# Altium schematic sheet 1.MCU_IOBANK.SchDoc
size A3; DocumentNumber: 2; SheetNumber: 2; SheetTotal: 6
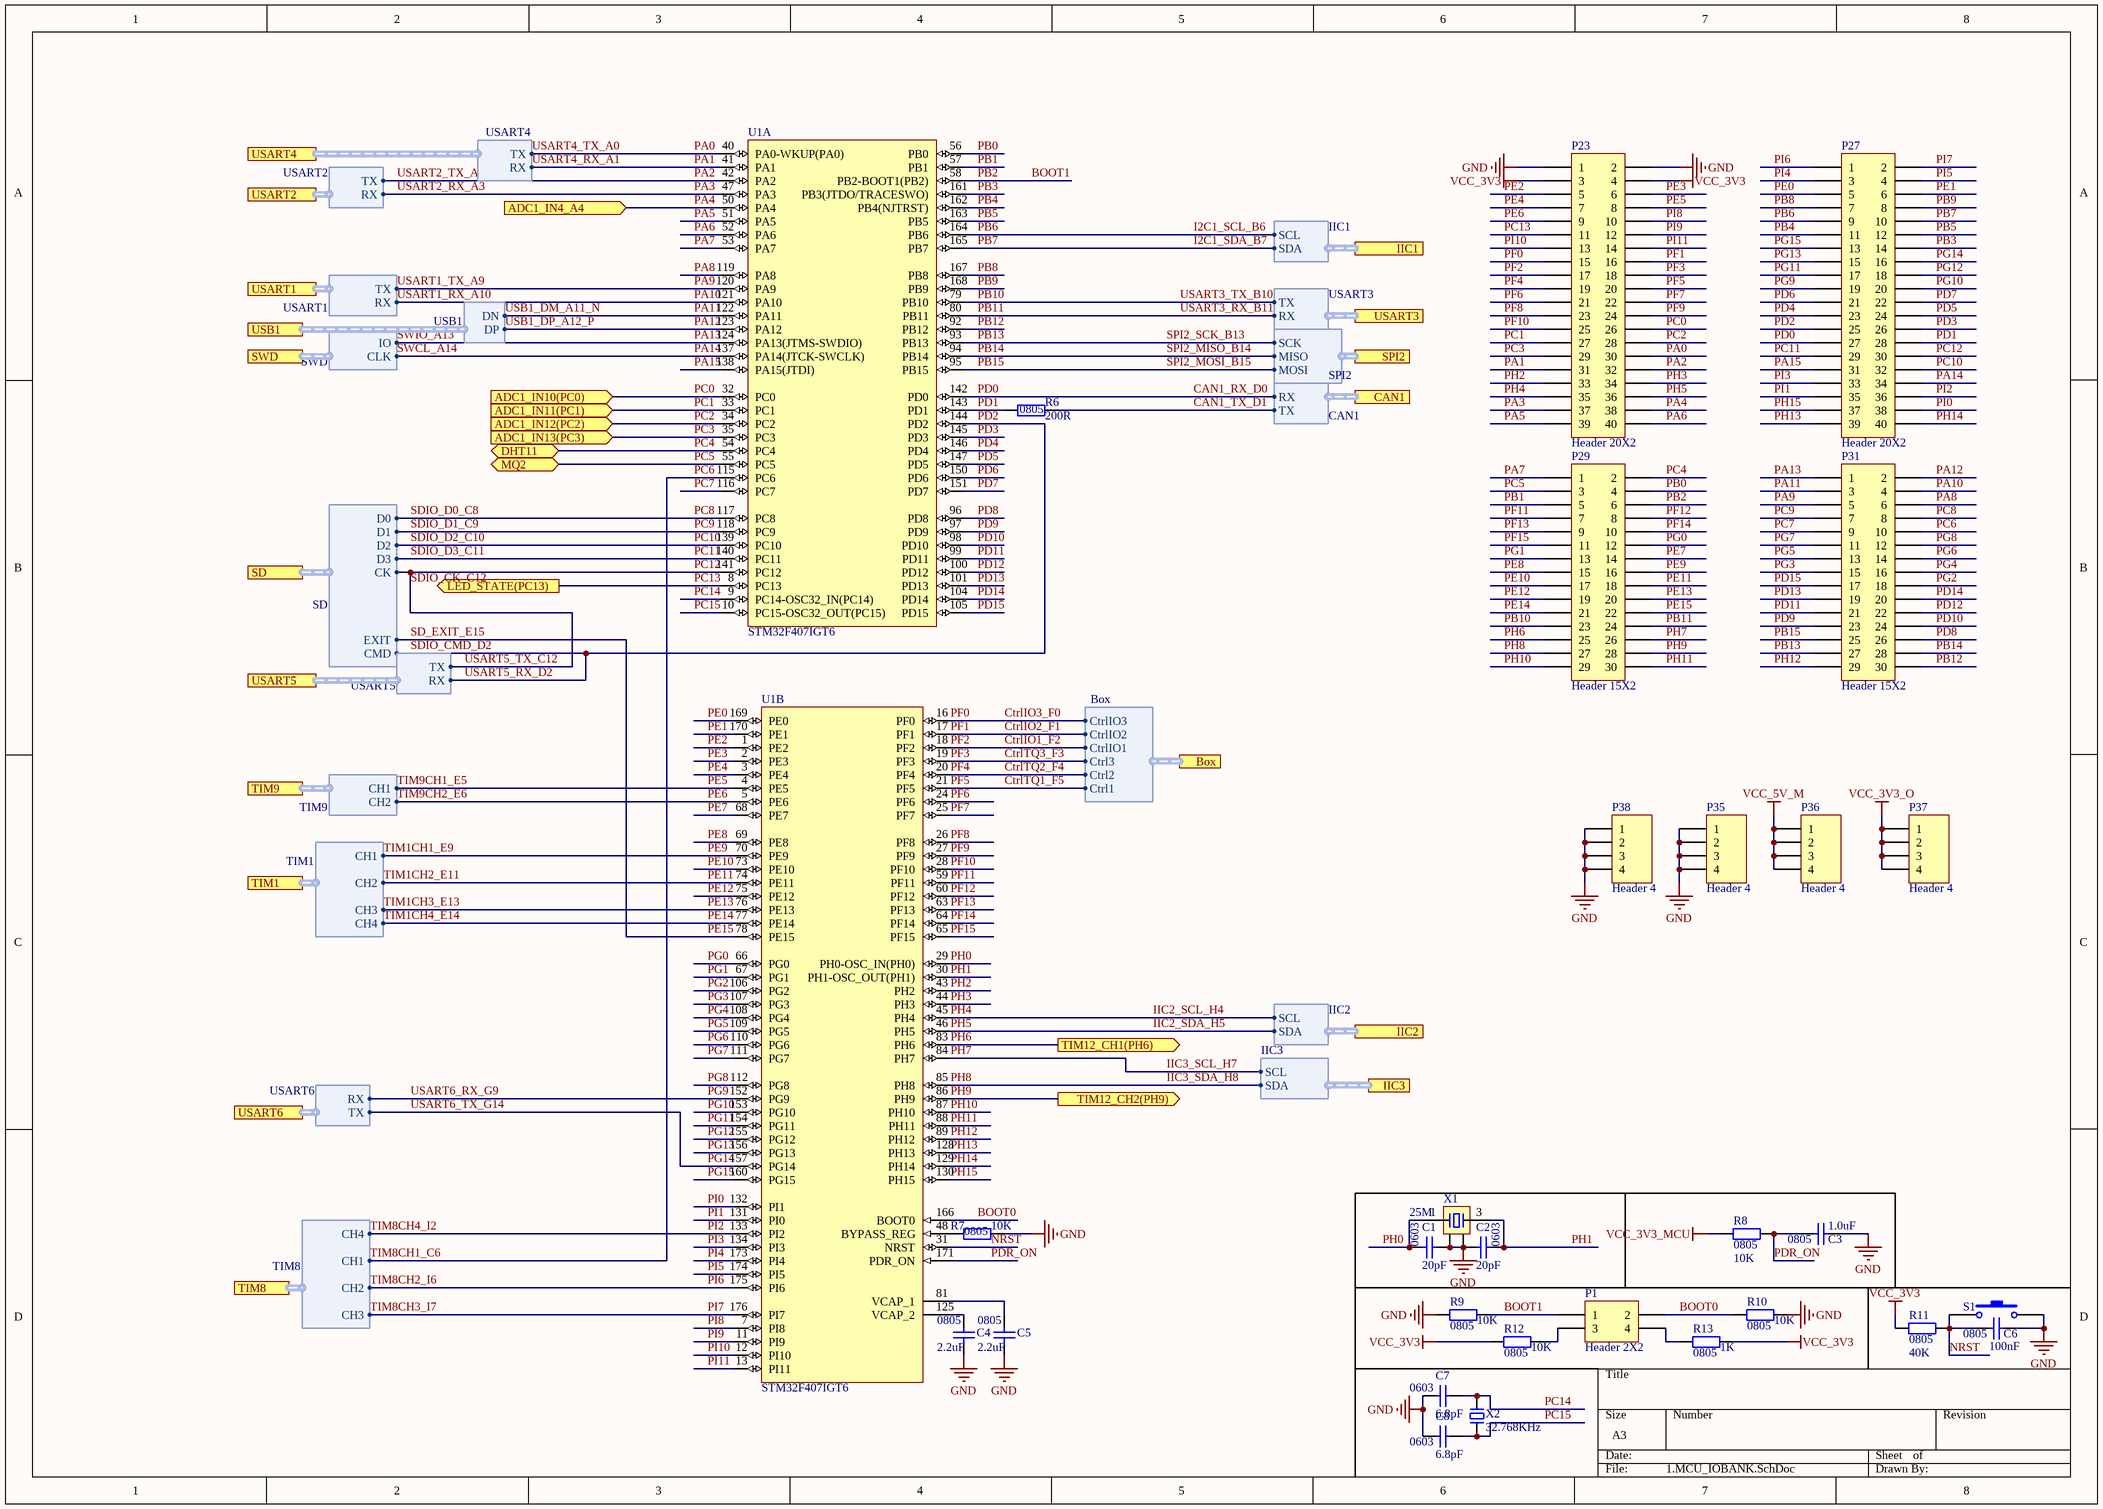
[diagram p0: 1.MCU_IOBANK.SchDoc]

## Parts
C1  0603  value 20pF  [C 0603_L]
C2  0603  value 20pF  [C 0603_L]
C3  0805  value 1.0uF  [C 0805_M]
C4  0805  value 2.2uF  [C 0805_M]
C5  0805  value 2.2uF  [C 0805_M]
C6  0805  value 100nF  [C 0805_M]
C7  0603  value 6.8pF  [C 0603_M]
C8  0603  value 6.8pF  [C 0603_L]
P1  Header 2X2  [HDR2.54-LI-2x2P]
P23  Header 20X2  [HDR2X20]
P27  Header 20X2  [HDR2X20]
P29  Header 15X2  [HDR2X15]
P31  Header 15X2  [HDR2X15]
P35  Header 4  [HDR2.54-LI-4P]
P36  Header 4  [HDR2.54-LI-4P]
P37  Header 4  [HDR2.54-LI-4P]
P38  Header 4  [HDR2.54-LI-4P]
R6  0805  value 200R  [R 0805_L]
R7  0805  value 10K  [R 0805_L]
R8  0805  value 10K  [R 0805_L]
R9  0805  value 10K  [R 0805_L]
R10  0805  value 10K  [R 0805_L]
R11  0805  value 40K  [R 0805_L]
R12  0805  value 10K  [R 0805_L]
R13  0805  value 1K  [R 0805_L]
S1  SW  [TSW DIP-3*6*5]  (value not drawn)
U1  STM32F407IGT6  [STM-LQFP176_N]  (parts A,B of 3)
X1  25M  [XTAL-3225]
X2  32.768KHz  [XTAL-3215A]

## Ports
ADC1_IN4_A4 (in), ADC1_IN10(PC0) (in), ADC1_IN11(PC1) (in), ADC1_IN12(PC2) (in), ADC1_IN13(PC3) (in), Box (harness Box), CAN1 (harness CAN1), DHT11 (bidir), IIC1 (harness IIC1), IIC2 (harness IIC2), IIC3 (harness IIC3), LED_STATE(PC13) (out), MQ2 (bidir), SD (harness SD), SPI2 (harness SPI2), SWD (harness SWD), TIM1 (harness TIM1), TIM8 (harness TIM8), TIM9 (harness TIM9), TIM12_CH1(PH6) (out), TIM12_CH2(PH9) (out), USART1 (harness USART1), USART2 (harness USART2), USART3 (harness USART3), USART4 (harness USART4), USART5 (harness USART5), USART6 (harness USART6), USB1 (harness USB1)

## Harnesses
TIM1: CH1, CH2, CH3, CH4
TIM8: CH1, CH2, CH3, CH4
USART1: RX, TX
TIM9: CH1, CH2
SPI2: MOSI, MISO, SCK
SD: EXIT, D1, D0, CK, CMD, D3, D2
USART2: TX, RX
USART3: RX, TX
USART6: TX, RX
SWD: IO, CLK
CAN1: TX, RX
USB1: DN, DP
USART4: TX, RX
USART5: TX, RX
IIC1: SCL, SDA
IIC2: SCL, SDA
IIC3: SDA, SCL
Box: Ctrl1, Ctrl2, Ctrl3, CtrlIO1, CtrlIO2, CtrlIO3

## Nets
GND: C1.2 C2.1 C3.1 C4.1 C5.1 C6.1 C7.1 C8.1 P23.1 P23.2 P35.1 P35.2 P35.3 P35.4 P38.1 P38.2 P38.3 P38.4 R7.2 R9.1 R10.2 S1.2 X1.2 X1.4
VCC_3V3: P23.3 P23.4 R11.1 R12.1 R13.2
VCC_3V3_MCU: R8.1
VCC_3V3_O: P37.1 P37.2 P37.3 P37.4
VCC_5V_M: P36.1 P36.2 P36.3 P36.4
BOOT0: P1.2 R10.1 U1.166(BOOT0)
BOOT1: P1.1 P29.6 R9.2 U1.58(PB2-BOOT1(PB2))  [also labelled PB2]
CAN1_RX_D0: P27.27 U1.142(PD0) ; port CAN1.RX  [also labelled PD0]
CAN1_TX_D1: R6.2 ; port CAN1.TX
CtrlIO1_F2: P23.17 U1.18(PF2) ; port Box.CtrlIO1  [also labelled PF2]
CtrlIO2_F1: P23.16 U1.17(PF1) ; port Box.CtrlIO2  [also labelled PF1]
CtrlIO3_F0: P23.15 U1.16(PF0) ; port Box.CtrlIO3  [also labelled PF0]
CtrlTQ1_F5: P23.20 U1.21(PF5) ; port Box.Ctrl1  [also labelled PF5]
CtrlTQ2_F4: P23.19 U1.20(PF4) ; port Box.Ctrl2  [also labelled PF4]
CtrlTQ3_F3: P23.18 U1.19(PF3) ; port Box.Ctrl3  [also labelled PF3]
I2C1_SCL_B6: P27.9 U1.164(PB6) ; port IIC1.SCL  [also labelled PB6]
I2C1_SDA_B7: P27.10 U1.165(PB7) ; port IIC1.SDA  [also labelled PB7]
IIC2_SCL_H4: P23.35 U1.45(PH4) ; port IIC2.SCL  [also labelled PH4]
IIC2_SDA_H5: P23.36 U1.46(PH5) ; port IIC2.SDA  [also labelled PH5]
IIC3_SCL_H7: P29.26 U1.84(PH7) ; port IIC3.SCL  [also labelled PH7]
IIC3_SDA_H8: P29.27 U1.85(PH8) ; port IIC3.SDA  [also labelled PH8]
NRST: C6.2 R11.2 S1.1 U1.31(NRST)
PA0: P23.30 U1.40(PA0-WKUP(PA0)) ; port USART4.TX  [also labelled USART4_TX_A0]
PA1: P23.31 U1.41(PA1) ; port USART4.RX  [also labelled USART4_RX_A1]
PA2: P23.32 U1.42(PA2) ; port USART2.TX  [also labelled USART2_TX_A2]
PA3: P23.37 U1.47(PA3) ; port USART2.RX  [also labelled USART2_RX_A3]
PA4: P23.38 U1.50(PA4) ; port ADC1_IN4_A4
PA5: P23.39 U1.51(PA5)
PA6: P23.40 U1.52(PA6)
PA7: P29.1 U1.53(PA7)
PA8: P31.6 U1.119(PA8)
PA9: P31.5 U1.120(PA9) ; port USART1.TX  [also labelled USART1_TX_A9]
PA10: P31.4 U1.121(PA10) ; port USART1.RX  [also labelled USART1_RX_A10]
PA11: P31.3 U1.122(PA11) ; port USB1.DN  [also labelled USB1_DM_A11_N]
PA12: P31.2 U1.123(PA12) ; port USB1.DP  [also labelled USB1_DP_A12_P]
PA13: P31.1 U1.124(PA13(JTMS-SWDIO)) ; port SWD.IO  [also labelled SWIO_A13]
PA14: P27.34 U1.137(PA14(JTCK-SWCLK)) ; port SWD.CLK  [also labelled SWCL_A14]
PA15: P27.31 U1.138(PA15(JTDI))
PB0: P29.4 U1.56(PB0)
PB1: P29.5 U1.57(PB1)
PB3: P27.14 U1.161(PB3(JTDO/TRACESWO))
PB4: P27.11 U1.162(PB4(NJTRST))
PB5: P27.12 U1.163(PB5)
PB8: P27.7 U1.167(PB8)
PB9: P27.8 U1.168(PB9)
PB10: P29.23 U1.79(PB10) ; port USART3.TX  [also labelled USART3_TX_B10]
PB11: P29.24 U1.80(PB11) ; port USART3.RX  [also labelled USART3_RX_B11]
PB12: P31.30 U1.92(PB12)
PB13: P31.27 U1.93(PB13) ; port SPI2.SCK  [also labelled SPI2_SCK_B13]
PB14: P31.28 U1.94(PB14) ; port SPI2.MISO  [also labelled SPI2_MISO_B14]
PB15: P31.25 U1.95(PB15) ; port SPI2.MOSI  [also labelled SPI2_MOSI_B15]
PC0: P23.26 U1.32(PC0) ; port ADC1_IN10(PC0)
PC1: P23.27 U1.33(PC1) ; port ADC1_IN11(PC1)
PC2: P23.28 U1.34(PC2) ; port ADC1_IN12(PC2)
PC3: P23.29 U1.35(PC3) ; port ADC1_IN13(PC3)
PC4: P29.2 U1.54(PC4) ; port DHT11
PC5: P29.3 U1.55(PC5) ; port MQ2
PC6: P31.10 U1.115(PC6) ; port TIM8.CH1  [also labelled TIM8CH1_C6]
PC7: P31.9 U1.116(PC7)
PC8: P31.8 U1.117(PC8) ; port SD.D0  [also labelled SDIO_D0_C8]
PC9: P31.7 U1.118(PC9) ; port SD.D1  [also labelled SDIO_D1_C9]
PC10: P27.32 U1.139(PC10) ; port SD.D2  [also labelled SDIO_D2_C10]
PC11: P27.29 U1.140(PC11) ; port SD.D3  [also labelled SDIO_D3_C11]
PC12: P27.30 U1.141(PC12) ; port SD.CK, port USART5.TX  [also labelled SDIO_CK_C12, USART5_TX_C12]
PC13: P23.11 U1.8(PC13) ; port LED_STATE(PC13)
PC14: C7.2 U1.9(PC14-OSC32_IN(PC14)) X2.2
PC15: C8.2 U1.10(PC15-OSC32_OUT(PC15)) X2.1
PD1: P27.28 R6.1 U1.143(PD1)
PD2: P27.25 U1.144(PD2) ; port SD.CMD, port USART5.RX  [also labelled SDIO_CMD_D2, USART5_RX_D2]
PD3: P27.26 U1.145(PD3)
PD4: P27.23 U1.146(PD4)
PD5: P27.24 U1.147(PD5)
PD6: P27.21 U1.150(PD6)
PD7: P27.22 U1.151(PD7)
PD8: P31.26 U1.96(PD8)
PD9: P31.23 U1.97(PD9)
PD10: P31.24 U1.98(PD10)
PD11: P31.21 U1.99(PD11)
PD12: P31.22 U1.100(PD12)
PD13: P31.19 U1.101(PD13)
PD14: P31.20 U1.104(PD14)
PD15: P31.17 U1.105(PD15)
PDR_ON: C3.2 R8.2 U1.171(PDR_ON)
PE0: P27.5 U1.169(PE0)
PE1: P27.6 U1.170(PE1)
PE2: P23.5 U1.1(PE2)
PE3: P23.6 U1.2(PE3)
PE4: P23.7 U1.3(PE4)
PE5: P23.8 U1.4(PE5) ; port TIM9.CH1  [also labelled TIM9CH1_E5]
PE6: P23.9 U1.5(PE6) ; port TIM9.CH2  [also labelled TIM9CH2_E6]
PE7: P29.14 U1.68(PE7)
PE8: P29.15 U1.69(PE8)
PE9: P29.16 U1.70(PE9) ; port TIM1.CH1  [also labelled TIM1CH1_E9]
PE10: P29.17 U1.73(PE10)
PE11: P29.18 U1.74(PE11) ; port TIM1.CH2  [also labelled TIM1CH2_E11]
PE12: P29.19 U1.75(PE12)
PE13: P29.20 U1.76(PE13) ; port TIM1.CH3  [also labelled TIM1CH3_E13]
PE14: P29.21 U1.77(PE14) ; port TIM1.CH4  [also labelled TIM1CH4_E14]
PE15: P29.22 U1.78(PE15) ; port SD.EXIT  [also labelled SD_EXIT_E15]
PF6: P23.21 U1.24(PF6)
PF7: P23.22 U1.25(PF7)
PF8: P23.23 U1.26(PF8)
PF9: P23.24 U1.27(PF9)
PF10: P23.25 U1.28(PF10)
PF11: P29.7 U1.59(PF11)
PF12: P29.8 U1.60(PF12)
PF13: P29.9 U1.63(PF13)
PF14: P29.10 U1.64(PF14)
PF15: P29.11 U1.65(PF15)
PG0: P29.12 U1.66(PG0)
PG1: P29.13 U1.67(PG1)
PG2: P31.18 U1.106(PG2)
PG3: P31.15 U1.107(PG3)
PG4: P31.16 U1.108(PG4)
PG5: P31.13 U1.109(PG5)
PG6: P31.14 U1.110(PG6)
PG7: P31.11 U1.111(PG7)
PG8: P31.12 U1.112(PG8)
PG9: P27.19 U1.152(PG9) ; port USART6.RX  [also labelled USART6_RX_G9]
PG10: P27.20 U1.153(PG10)
PG11: P27.17 U1.154(PG11)
PG12: P27.18 U1.155(PG12)
PG13: P27.15 U1.156(PG13)
PG14: P27.16 U1.157(PG14) ; port USART6.TX  [also labelled USART6_TX_G14]
PG15: P27.13 U1.160(PG15)
PH0: C1.1 U1.29(PH0-OSC_IN(PH0)) X1.1
PH1: C2.2 U1.30(PH1-OSC_OUT(PH1)) X1.3
PH2: P23.33 U1.43(PH2)
PH3: P23.34 U1.44(PH3)
PH6: P29.25 U1.83(PH6) ; port TIM12_CH1(PH6)
PH9: P29.28 U1.86(PH9) ; port TIM12_CH2(PH9)
PH10: P29.29 U1.87(PH10)
PH11: P29.30 U1.88(PH11)
PH12: P31.29 U1.89(PH12)
PH13: P27.39 U1.128(PH13)
PH14: P27.40 U1.129(PH14)
PH15: P27.37 U1.130(PH15)
PI0: P27.38 U1.132(PI1)
PI1: P27.35 U1.131(PI0)
PI2: P27.36 U1.133(PI2) ; port TIM8.CH4  [also labelled TIM8CH4_I2]
PI3: P27.33 U1.134(PI3)
PI4: P27.3 U1.173(PI4)
PI5: P27.4 U1.174(PI5)
PI6: P27.1 U1.175(PI6) ; port TIM8.CH2  [also labelled TIM8CH2_I6]
PI7: P27.2 U1.176(PI7) ; port TIM8.CH3  [also labelled TIM8CH3_I7]
PI8: P23.10 U1.7(PI8)
PI9: P23.12 U1.11(PI9)
PI10: P23.13 U1.12(PI10)
PI11: P23.14 U1.13(PI11)
NetC4_2: C4.2 U1.125(VCAP_2)
NetC5_2: C5.2 U1.81(VCAP_1)
NetP1_3: P1.3 R12.2
NetP1_4: P1.4 R13.1
NetR7_1: R7.1 U1.48(BYPASS_REG)

## Library data of the parts
C1-C8 = CAP
P1 = Header 2X2: Header, 2-Pin, Dual row; LatestRevisionDate: 17-Jul-2002; LatestRevisionNote: Re-released for DXP Platform.; Publisher: Altium Limited
P23 P27 = Header 20X2: Header, 20-Pin, Dual row; LatestRevisionDate: 17-Jul-2002; LatestRevisionNote: Re-released for DXP Platform.; Publisher: Altium Limited
P29 P31 = Header 15X2: Header, 15-Pin, Dual row; LatestRevisionDate: 17-Jul-2002; LatestRevisionNote: Re-released for DXP Platform.; Publisher: Altium Limited
P35-P38 = Header 4: Header, 4-Pin; LatestRevisionDate: 17-Jul-2002; LatestRevisionNote: Re-released for DXP Platform.; Publisher: Altium Limited
R6-R13 = RES2: Resistor; Published: 8-Jun-2000; LatestRevisionDate: 17-Jul-2002; LatestRevisionNote: Re-released for DXP Platform.; PackageReference: AXIAL-0.3; Publisher: Altium Limited; PackageDescription: Axial Device, Thru-Hole; 2 Leads; 0.3 in Pin Spacing
U1 = STM32F407IGT6: ARM Cortex-M4 32-bit MCU+FPU, 210 DMIPS, 1024 kB Flash, 192 kB Internal RAM, 140 I/Os, 176-pin LQFP, -40 to 85 degC, Tray; Manufacturer: STMicroelectronics; D/A Converter: 2x12-bit; FLASH Size (Prog) (kB): 1024; I/Os (High Current): 140; Internal RAM Size (kB): 192; Operating Frequency(F) (Processor speed) (MHz): 168; Supply Voltage(Vcc) max (V): 3.6; Supply Voltage(Vcc) min (V): 1.8; DatasheetVersion: Rev. 4; PackageVersion: Rev. 4, 06/2013; PackageReference: LQFP176; PackageDescription: 176-Pin Low Profile Quad Flat Package, 24 x 24 mm Body, 0.5 mm Pitch; Supplier 1: Digi-Key; Supplier Part Number 1: 497-11604-ND; Supplier 2: Farnell; Supplier Part Number 2: 2064366; Supplier 3: Newark; Supplier Part Number 3: 73T2331; Supplier 4: Mouser; Supplier Part Number 4: 511-STM32F407IGT6; Core: ARM Cortex-M4; Packing: Tray; Mounting Technology: Surface Mount; PartNumber: STM32F407IGT6; ComponentLink1Description: Manufacturer URL; ComponentLink1URL: http://www.st.com/web/en/home.html; ComponentLink2Description: Datasheet; ComponentLink2URL: http://www.st.com/st-web-ui/static/active/en/resource/technical/document/datasheet/DM00037051.pdf; ComponentLink3Description: Package Specification; ComponentLink3URL: http://www.st.com/st-web-ui/static/active/en/resource/technical/document/datasheet/DM00035129.pdf
X1 = XTAL-4: 4脚晶振; 版权归属: 源创客; BOM名称: 4脚晶振; 学习资源: www.ooocke.com
X2 = XTAL-2: 2脚晶振; 版权归属: 源创客; BOM名称: 2脚晶振; 学习资源: www.ooocke.com
S1 = SW: Published: 24-Mar-1999; LatestRevisionDate: 17-Jul-2002; LatestRevisionNote: Re-released for DXP Platform.; Publisher: Altium Limited